# Altium schematic sheet Solar System Overview.SchDoc
size A4; SheetNumber: 1; SheetTotal: 3
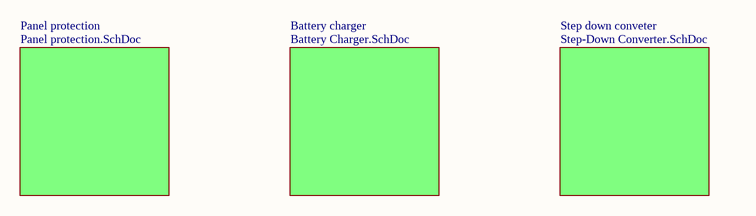
[diagram p0: Solar System Overview.SchDoc]

## Sub-sheets
Battery charger = Battery Charger.SchDoc: no entries
Panel protection = Panel protection.SchDoc: no entries
Step down conveter = Step-Down Converter.SchDoc: no entries